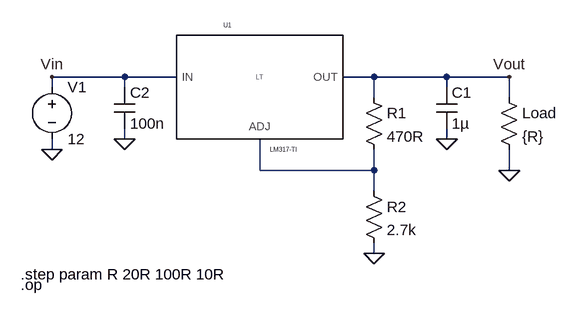
[diagram p0: schematic LM317 Standard Application (figure 1 On Semiconductor).asc]
LM317 Standard Application (figure 1 On Semiconductor).asc, the LTspice schematic file:
Version 4
SHEET 1 880 680
WIRE -64 96 -176 96
WIRE 16 96 -64 96
WIRE 320 96 272 96
WIRE 432 96 320 96
WIRE 528 96 432 96
WIRE -176 112 -176 96
WIRE -64 112 -64 96
WIRE 432 112 432 96
WIRE 320 128 320 96
WIRE 528 128 528 96
WIRE -64 192 -64 176
WIRE 432 192 432 176
WIRE -176 208 -176 192
WIRE 144 240 144 192
WIRE 320 240 320 208
WIRE 320 240 144 240
WIRE 528 240 528 208
WIRE 320 272 320 240
WIRE 320 368 320 352
FLAG 320 368 0
FLAG -64 192 0
FLAG -176 208 0
FLAG 528 96 Vout
FLAG -176 96 Vin
FLAG 528 240 0
FLAG 432 192 0
SYMBOL Regulators\\LM317-TI 144 96 R0
SYMATTR InstName U1
SYMBOL cap -80 112 R0
SYMATTR InstName C2
SYMATTR Value 100n
SYMBOL res 304 112 R0
SYMATTR InstName R1
SYMATTR Value 470R
SYMBOL res 304 256 R0
SYMATTR InstName R2
SYMATTR Value 2.7k
SYMBOL voltage -176 96 R0
WINDOW 123 0 0 Left 0
WINDOW 39 0 0 Left 0
SYMATTR InstName V1
SYMATTR Value 12
SYMBOL res 512 112 R0
SYMATTR InstName Load
SYMATTR Value {R}
SYMBOL cap 416 112 R0
SYMATTR InstName C1
SYMATTR Value 1µ
TEXT -224 416 Left 2 !.op
TEXT -224 400 Left 2 !.step param R 20R 100R 10R

The netlist it stands for:
* LM317 Standard Application (figure 1 On Semiconductor).asc
XU1 Vin N001 Vout LM317-TI  ; pins IN ADJ OUT
C2 Vin 0 100n
R1 Vout N001 470R
R2 N001 0 2.7k
V1 Vin 0 12
R§Load Vout 0 {R}
C1 Vout 0 1µ
.op
.step param R 20R 100R 10R
.lib LM317-TI.LIB
.backanno
.end